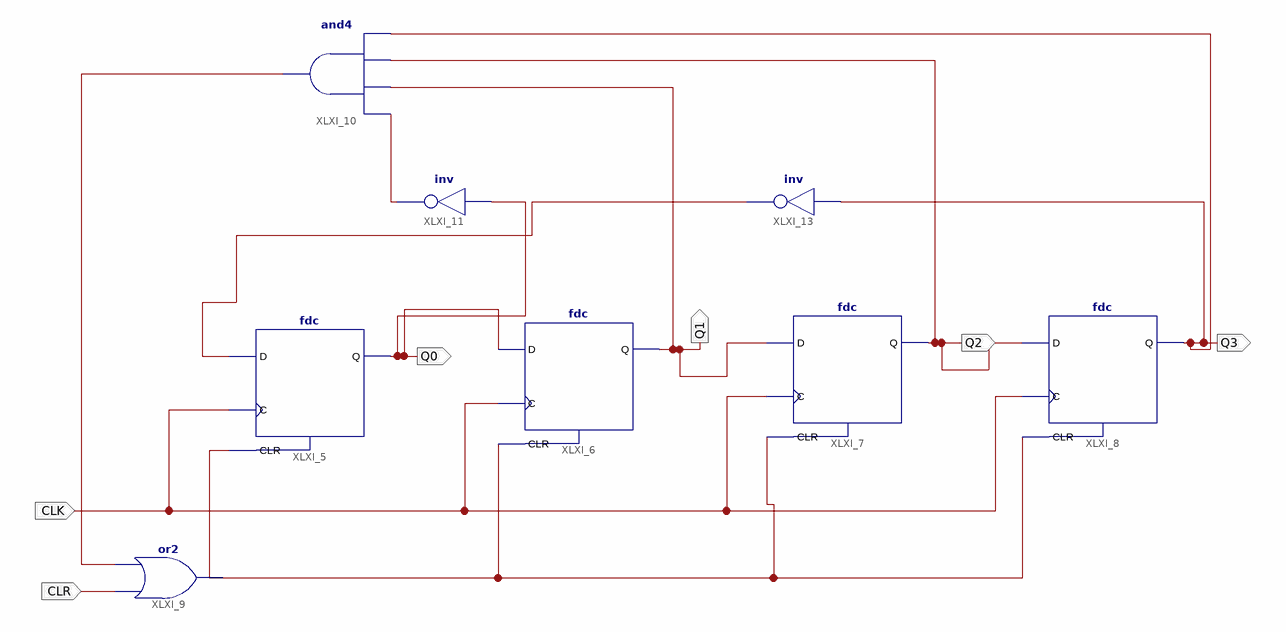
[diagram p0: schematic sheet 1]
// Xilinx ISE schematic p1ej11.sch (spartan3e) as structural Verilog: 8 symbols, 6 ports
module p1ej11 (
  input  CLR,
  input  CLK,
  output Q0,
  output Q1,
  output Q2,
  output Q3
);

  wire XLXN_23, XLXN_25, XLXN_30;

  fdc XLXI_5 (.C(CLK), .CLR(CLR), .D(XLXN_30), .Q(Q0));
  fdc XLXI_6 (.C(CLK), .CLR(CLR), .D(Q0), .Q(Q1));
  fdc XLXI_7 (.C(CLK), .CLR(CLR), .D(Q1), .Q(Q2));
  fdc XLXI_8 (.C(CLK), .CLR(CLR), .D(Q2), .Q(Q3));
  or XLXI_9 (CLR, CLR, XLXN_23);
  and XLXI_10 (XLXN_23, Q3, Q2, Q1, XLXN_25);
  not XLXI_11 (XLXN_25, Q0);
  not XLXI_13 (XLXN_30, Q3);
endmodule
